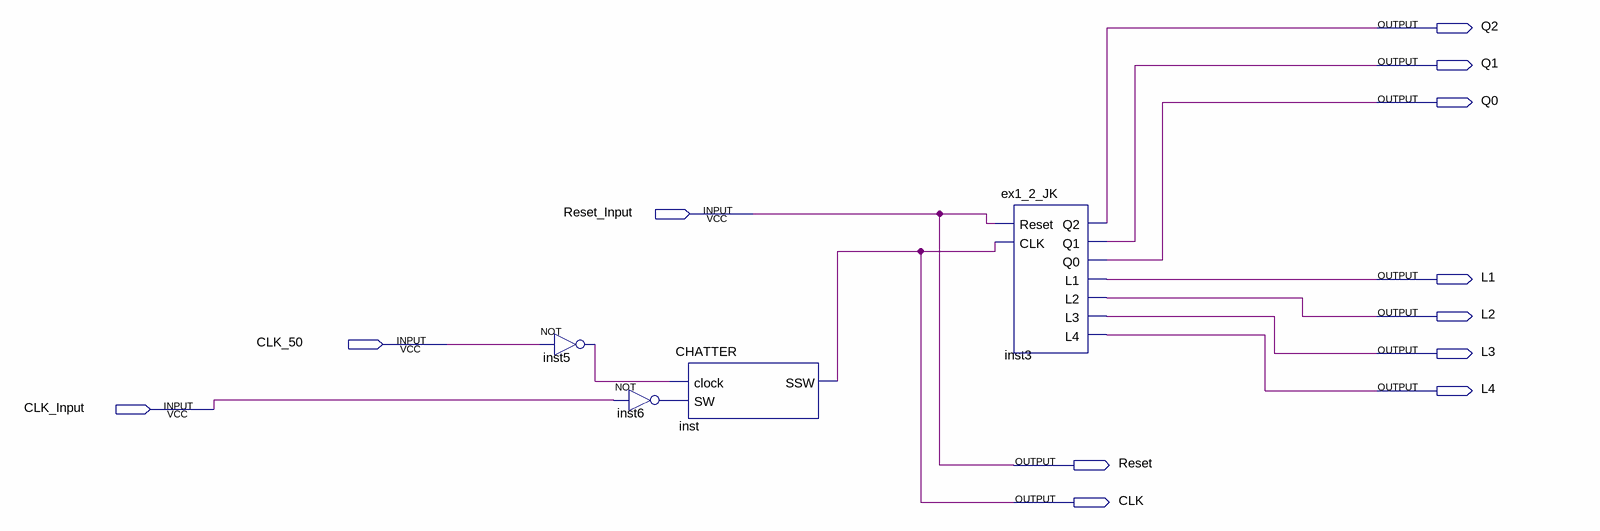
[diagram p0: schematic sheet]
// Quartus schematic interface_JKDice.bdf as structural Verilog: 4 symbols, 12 pins
module interface_JKDice (
  input  Reset_Input,
  input  CLK_50,
  input  CLK_Input,
  output Q2,
  output Q1,
  output Q0,
  output L1,
  output L2,
  output L3,
  output L4,
  output Reset,
  output CLK
);

  wire inst5_out, inst6_out;

  not inst5 (inst5_out, CLK_50);
  not inst6 (inst6_out, CLK_Input);
  CHATTER inst (.clock(inst5_out), .SW(inst6_out), .SSW(CLK));
  ex1_2_JK inst3 (.Reset(Reset_Input), .CLK(CLK), .Q2(Q2), .Q1(Q1), .Q0(Q0), .L1(L1), .L2(L2), .L3(L3), .L4(L4));

  assign Reset = Reset_Input;
endmodule
